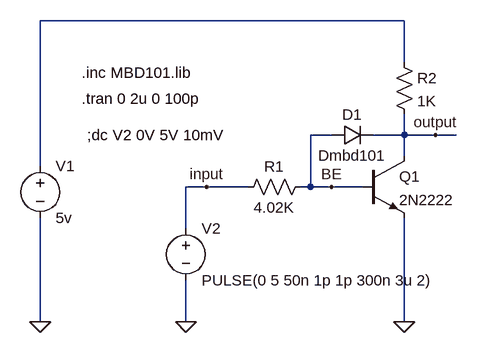
[diagram p0: schematic Sweep.asc]
Sweep.asc, the LTspice schematic file:
Version 4
SHEET 1 880 680
WIRE 0 0 -560 0
WIRE 0 64 0 0
WIRE -112 176 -144 176
WIRE 0 176 0 144
WIRE 0 176 -48 176
WIRE 48 176 0 176
WIRE 80 176 48 176
WIRE 0 208 0 176
WIRE -560 224 -560 0
WIRE -304 256 -336 256
WIRE -240 256 -304 256
WIRE -144 256 -144 176
WIRE -144 256 -160 256
WIRE -112 256 -144 256
WIRE -64 256 -112 256
WIRE -336 320 -336 256
WIRE -560 464 -560 304
WIRE -336 464 -336 400
WIRE 0 464 0 304
FLAG -560 464 0
FLAG -336 464 0
FLAG 0 464 0
FLAG 48 176 output
FLAG -304 256 input
FLAG -112 256 BE
SYMBOL voltage -560 208 R0
SYMATTR InstName V1
SYMATTR Value 5v
SYMBOL res -144 240 R90
WINDOW 0 0 56 VBottom 2
WINDOW 3 32 56 VTop 2
SYMATTR InstName R1
SYMATTR Value 4.02K
SYMBOL voltage -336 304 R0
WINDOW 123 0 0 Left 2
WINDOW 39 0 0 Left 2
SYMATTR InstName V2
SYMATTR Value PULSE(0 5 50n 1p 1p 300n 3u 2)
SYMBOL res -16 48 R0
SYMATTR InstName R2
SYMATTR Value 1K
SYMBOL npn -64 208 R0
SYMATTR InstName Q1
SYMATTR Value 2N2222
SYMBOL diode -112 192 R270
WINDOW 0 32 32 VTop 2
WINDOW 3 0 32 VBottom 2
SYMATTR InstName D1
SYMATTR Value Dmbd101
TEXT -496 120 Left 2 !.tran 0 2u 0 100p
TEXT -496 80 Left 2 !.inc MBD101.lib
TEXT -488 176 Left 2 !;dc V2 0V 5V 10mV

The netlist it stands for:
* Sweep.asc
V1 N001 0 5v
R1 BE input 4.02K
V2 input 0 PULSE(0 5 50n 1p 1p 300n 3u 2)
R2 N001 output 1K
Q1 output BE 0 0 2N2222
D1 BE output Dmbd101
.model D D
.lib standard.dio
.model NPN NPN
.model PNP PNP
.lib standard.bjt
.tran 0 2u 0 100p
.inc MBD101.lib
;dc V2 0V 5V 10mV
.backanno
.end

* Results of the author's LTspice run, read from the files saved beside the schematic
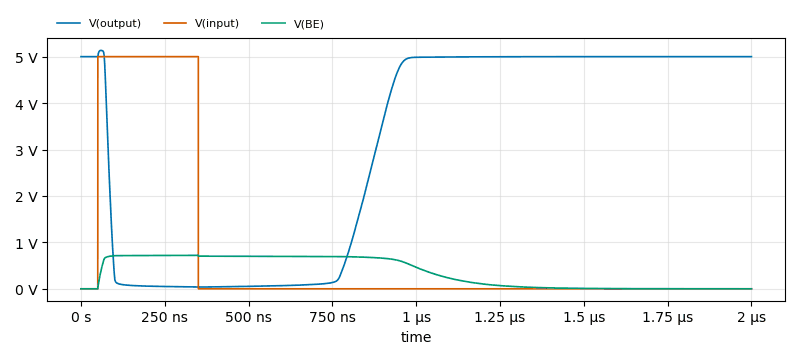
[diagram p1: Transient Analysis of Sweep.asc, plotted from the saved traces]
* Transient Analysis, 1 run:
*   V(output): min 37.4 mV, max 5.135 V, average 3.08 V, rms 3.852 V, last 5 V
*   V(input): min 0 V, max 5 V, average 750 mV, rms 1.936 V, last 0 V
*   V(BE): min 0 V, max 720.4 mV, average 355.1 mV, rms 480.6 mV, last 120 µV